# Altium project QiTian Mini Flight control.PrjPcb
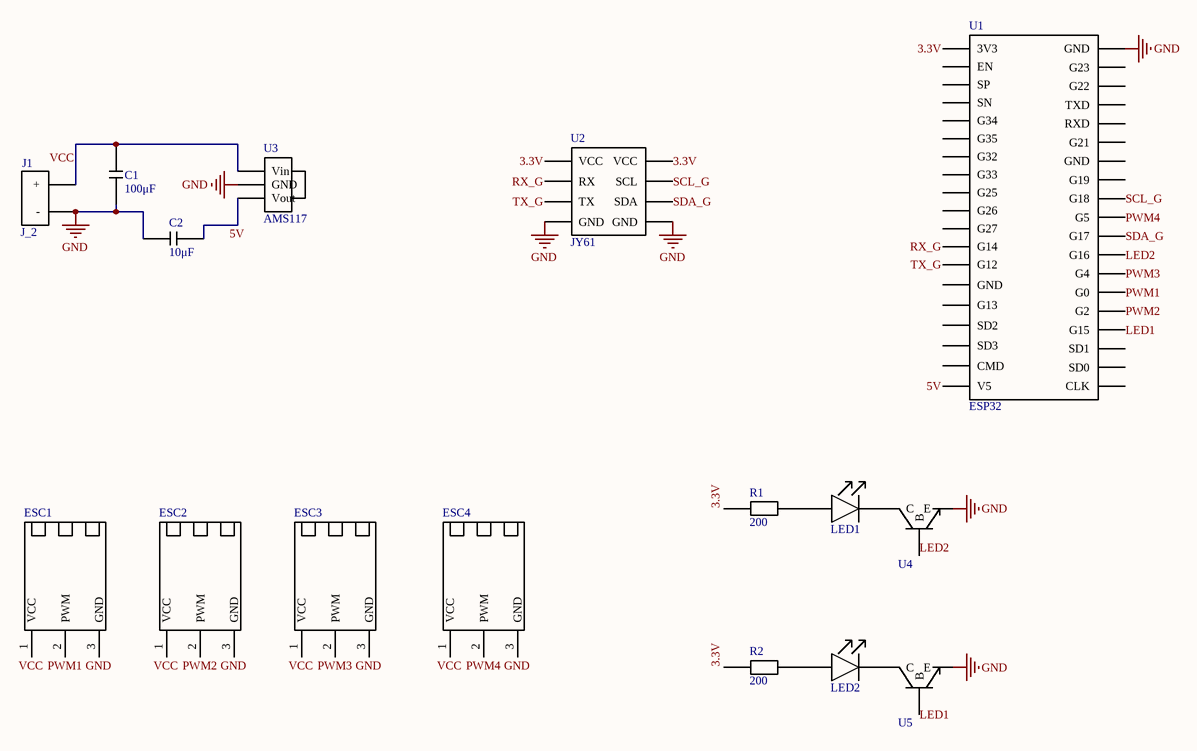
[diagram p0: QiTian Mini Flight Control.SchDoc]
1 sheet, 16 parts. Net scope: global (net labels, ports and power ports of the same name join across sheets).
Board file: QiTian Mini Flight Control.PcbDoc

## Sheet QiTian Mini Flight Control.SchDoc
size A4; SheetNumber: 1; SheetTotal: 1

### Parts
C1  100μF  [6032]
C2  10μF  [6032]
ESC1  ESC  [ESC]  (value not drawn)
ESC2  ESC  [ESC]  (value not drawn)
ESC3  ESC  [ESC]  (value not drawn)
ESC4  ESC  [ESC]  (value not drawn)
J1  J_2  [J_2P]
LED1  LED  [J_2]  (value not drawn)
LED2  LED  [J_2]  (value not drawn)
R1  200  [0603]
R2  200  [0603]
U1  ESP32  [ESP32]
U2  JY61  [JY61]
U3  AMS117  [SOT-89]
U4  U_S8050  [SOT-23]  (value not drawn)
U5  U_S8050  [SOT-23]  (value not drawn)

### Nets
GND: C1.1 C2.1 ESC1.3(GND) ESC2.3(GND) ESC3.3(GND) ESC4.3(GND) J1.2(-) U1.38(GND) U2.4(GND) U2.8(GND) U3.2(GND) U4.3(E) U5.3(E)
3.3V: R1.2 R2.2 U1.1(3V3) U2.1(VCC) U2.5(VCC)
5V: C2.2 U1.19(V5) U3.3(Vout)
LED1: U1.23(G15) U5.1(B)
LED2: U1.27(G16) U4.1(B)
PWM1: ESC1.2(PWM) U1.25(G0)
PWM2: ESC2.2(PWM) U1.24(G2)
PWM3: ESC3.2(PWM) U1.26(G4)
PWM4: ESC4.2(PWM) U1.29(G5)
RX_G: U1.12(G14) U2.2(RX)
SCL_G: U1.30(G18) U2.6(SCL)
SDA_G: U1.28(G17) U2.7(SDA)
TX_G: U1.13(G12) U2.3(TX)
VCC: C1.2 ESC1.1(VCC) ESC2.1(VCC) ESC3.1(VCC) ESC4.1(VCC) J1.1(+) U3.1(Vin)
NetLED1_1: LED1.1 R1.1
NetLED1_2: LED1.2 U4.2(C)
NetLED2_1: LED2.1 R2.1
NetLED2_2: LED2.2 U5.2(C)

Not connected (* = marked no-connect by the designer): U1 2(EN) 3(SP) 4(SN) 5(G34) 6(G35) 7(G32) 8(G33) 9(G25) 10(G26) 11(G27) 14(GND) 15(G13) 16(SD2) 17(SD3) 18(CMD) 20(CLK) 21(SD0) 22(SD1) 31(G19) 32(GND) 33(G21) 34(RXD) 35(TXD) 36(G22) 37(G23)

### Library data of the parts
C1 C2 = C: ComponentLink1Description: New link; ComponentLink1URL: *
R1 R2 = R
U1 = U_ESP32: ESP32开发底板
U3 = AMS117: pin to pad: 1>3 2>1 3>2